# Altium schematic sheet eth_100base-tx_magnetics.SchDoc
size A; SheetNumber: 9
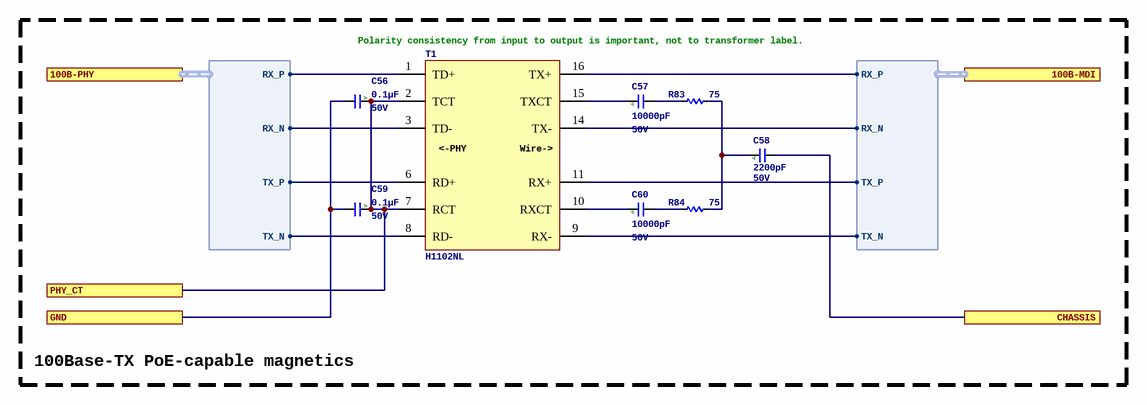
[diagram p0: eth_100base-tx_magnetics.SchDoc]

## Parts
C56  Capacitance: 0.1µF  Voltage - Rated: 50V  [C0402_0.55MM]  (hidden comment: CGA2B3X7R1H104M050BB)
C57  Capacitance: 10000pF  Voltage - Rated: 50V  [C0402_0.50MM]  (hidden comment: CGJ2B3X7R1H103K050BB)
C58  Capacitance: 2200pF  Voltage - Rated: 50V  [C0402_0.55MM]  (hidden comment: CGA2B2X7R1H222M050BA)
C59  Capacitance: 0.1µF  Voltage - Rated: 50V  [C0402_0.55MM]  (hidden comment: CGA2B3X7R1H104M050BB)
C60  Capacitance: 10000pF  Voltage - Rated: 50V  [C0402_0.50MM]  (hidden comment: CGJ2B3X7R1H103K050BB)
R83  Resistance: 75  [R0402_0.40MM]  (hidden comment: ERJ-2RKF75R0X)
R84  Resistance: 75  [R0402_0.40MM]  (hidden comment: ERJ-2RKF75R0X)
T1  H1102NL  [EPCOS_LAN_MODULE]

## Blocks framed on the sheet
100Base-TX PoE-capable magnetics: C56-C60 R83 R84 T1

## Ports
100B-MDI (harness 100BASE-TX), 100B-PHY (harness 100BASE-TX), CHASSIS, GND, PHY_CT

## Harnesses
100BASE-TX: RX_N, RX_P, TX_N, TX_P
100BASE-TX: TX_N, TX_P, RX_N, RX_P

## Nets
CHASSIS: C58.2 ; port CHASSIS
GND: C56.2 C59.2 ; port GND
PHY_CT: C56.1 C59.1 T1.2(TCT) T1.7(RCT) ; port PHY_CT
NetC57_1: C57.1 T1.15(TXCT)
NetC57_2: C57.2 R83.2
NetC58_1: C58.1 R83.1 R84.1
NetC60_1: C60.1 T1.10(RXCT)
NetC60_2: C60.2 R84.2
NetT1_1: T1.1(TD+) ; port 100B-PHY.RX_P
NetT1_3: T1.3(TD-) ; port 100B-PHY.RX_N
NetT1_6: T1.6(RD+) ; port 100B-PHY.TX_P
NetT1_8: T1.8(RD-) ; port 100B-PHY.TX_N
NetT1_9: T1.9(RX-) ; port 100B-MDI.TX_N
NetT1_11: T1.11(RX+) ; port 100B-MDI.TX_P
NetT1_14: T1.14(TX-) ; port 100B-MDI.RX_N
NetT1_16: T1.16(TX+) ; port 100B-MDI.RX_P

## Notes on the sheet
- (near T1) Polarity consistency from input to output is important, not to transformer label.
- (in symbol CGA2B2X7R1H222M050BA) A
- (in symbol CGA2B3X7R1H104M050BB) A
- (in symbol CGJ2B3X7R1H103K050BB) A
- (in symbol ETH_H1102NL) <-PHY; Wire->

## Library data of the parts
C56 C59 = CGA2B3X7R1H104M050BB: CAP CER 0.1UF 50V X7R 0402; Manufacturer: TDK Corporation; Unit Price (USD): 0.17; Tolerance: ±20%; ComponentLink1URL: https://product.tdk.com/info/en/catalog/datasheets/mlcc_automotive_general_en.pdf?ref_disty=digikey; ComponentLink1Description: Series Datasheet; Series: CGA; Part Status: Active; Temperature Coefficient: X7R; Operating Temperature: -55°C ~ 125°C; Applications: AEC-Q200; Mounting Type: Surface Mount, MLCC; Package / Case: 0402 (1005 Metric); Size / Dimension: 0.039" L x 0.020" W (1.00mm x 0.50mm); Thickness (Max): 0.022" (0.55mm); Supplier 1: Digikey; Supplier Part Number 1: 445-12271-1-ND; Manufacturer Part Number: CGA2B3X7R1H104M050BB
C57 C60 = CGJ2B3X7R1H103K050BB: CAP CER 10000PF 50V X7R 0402; Manufacturer: TDK Corporation; Unit Price (USD): 0.21; Tolerance: ±10%; ComponentLink1URL: https://product.tdk.com/info/en/catalog/datasheets/mlcc_highreliability_general_en.pdf?ref_disty=digikey; ComponentLink1Description: Series Datasheet; Series: CGJ; Part Status: Active; Temperature Coefficient: X7R; Operating Temperature: -55°C ~ 125°C; Applications: AEC-Q200; Mounting Type: Surface Mount, MLCC; Package / Case: 0402 (1005 Metric); Size / Dimension: 0.039" L x 0.020" W (1.00mm x 0.50mm); Thickness (Max): 0.020" (0.50mm); Supplier 1: Digikey; Supplier Part Number 1: 445-13304-1-ND; Manufacturer Part Number: CGJ2B3X7R1H103K050BB
C58 = CGA2B2X7R1H222M050BA: CAP CER 2200PF 50V X7R 0402; Manufacturer: TDK Corporation; Unit Price (USD): 0.1; Tolerance: ±20%; ComponentLink1URL: https://product.tdk.com/info/en/catalog/datasheets/mlcc_automotive_general_en.pdf?ref_disty=digikey; ComponentLink1Description: Series Datasheet; Supplier 1: Digikey; Supplier Part Number 1: 445-12274-1-ND; Series: CGA; Part Status: Active; Temperature Coefficient: X7R; Operating Temperature: -55°C ~ 125°C; Applications: AEC-Q200; Mounting Type: Surface Mount, MLCC; Package / Case: 0402 (1005 Metric); Size / Dimension: 0.039" L x 0.020" W (1.00mm x 0.50mm); Thickness (Max): 0.022" (0.55mm); Manufacturer Part Number: CGA2B2X7R1H222M050BA
R83 R84 = ERJ-2RKF75R0X: RES SMD 75 OHM 1% 1/10W 0402; Manufacturer: Panasonic Electronic Components; Unit Price (USD): 0.1; Power (Watts): 0.1W, 1/10W; Temperature Coefficient: ±100ppm/°C; ComponentLink1Description: Datasheet; ComponentLink1URL: https://industrial.panasonic.com/cdbs/www-data/pdf/RDA0000/AOA0000C304.pdf; Series: ERJ; Tolerance: ±1%; Composition: Thick Film; Features: Automotive AEC-Q200; Operating Temperature: -55°C ~ 155°C; Package / Case: 0402 (1005 Metric); Supplier Device Package: 0402; Size / Dimension: 0.039" L x 0.020" W (1.00mm x 0.50mm); Height - Seated (Max): 0.016" (0.40mm); Supplier 1: Digikey; Supplier Part Number 1: P75.0LCT-ND; Manufacturer Part Number: ERJ-2RKF75R0X
T1 = ETH_H1102NL: MODULE XFRMR SGL ETHR LAN 16SOIC; Manufacturer: Pulse Electronics Corporation; Supplier 1: Digikey; ComponentLink1URL: https://productfinder.pulseelectronics.com/api/open/part-attachments/datasheet/H1102NL; ComponentLink1Description: Datasheet; Supplier Part Number 1: 553-1323-ND; Manufacturer Part Number: H1102NL; Supplier 2: LCSC; Supplier Part Number 2: C18584